# EAGLE design main (EAGLE 9.5.2)
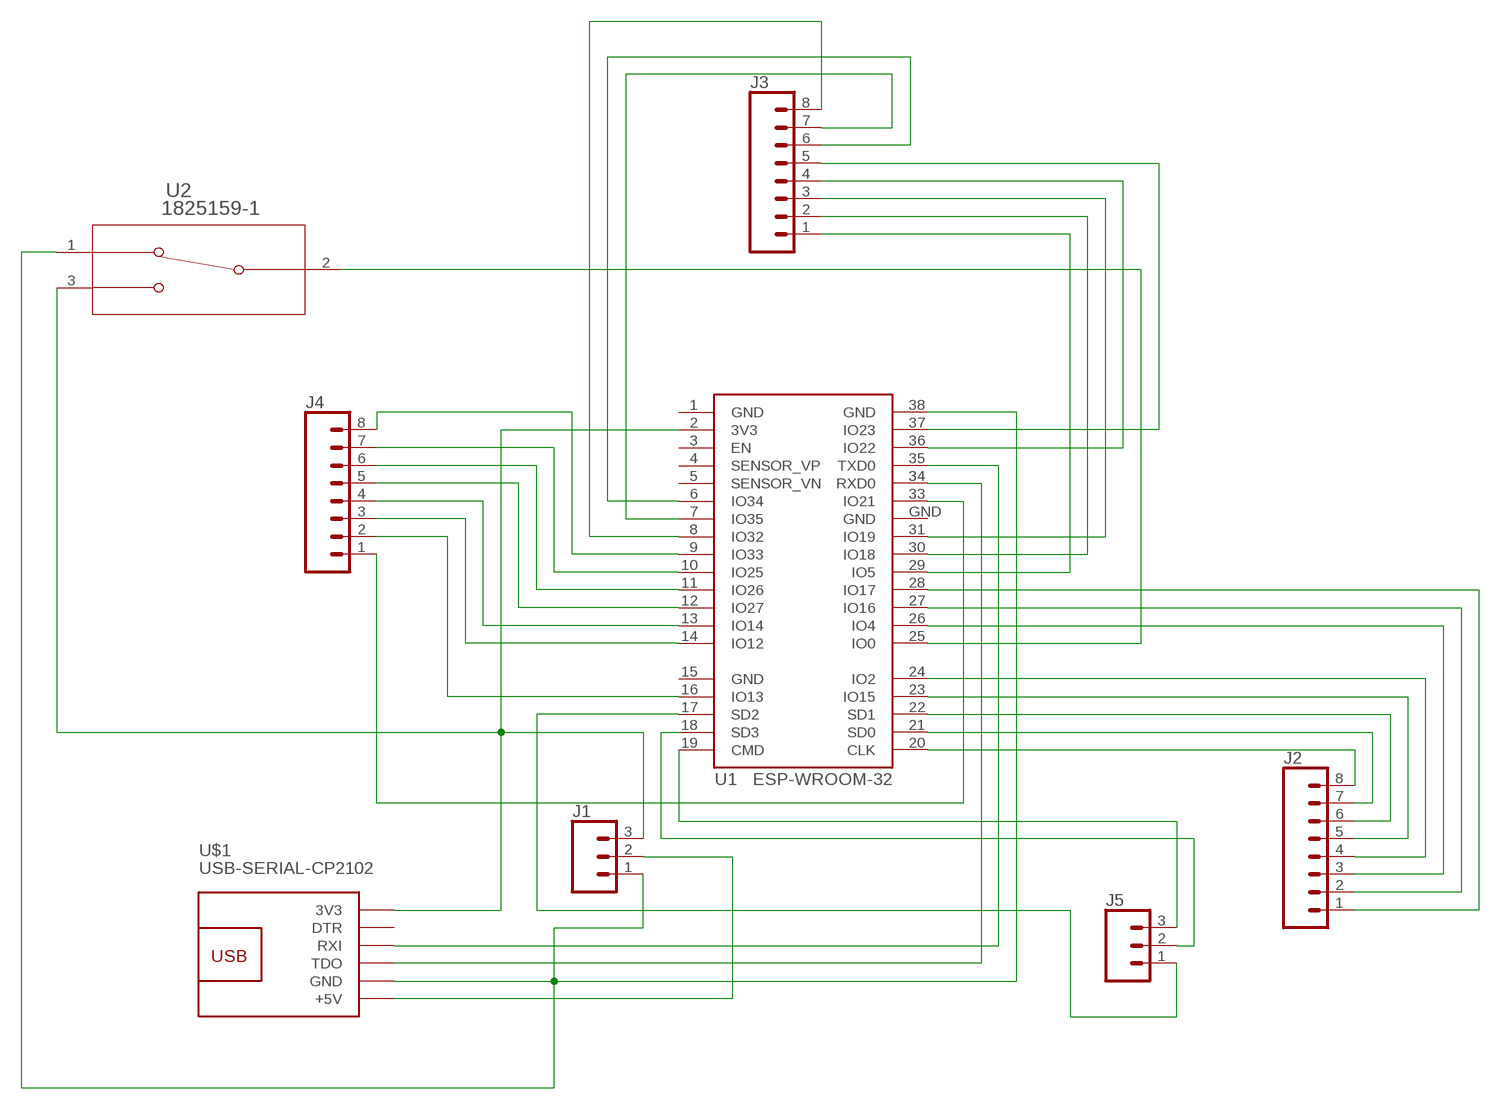
[diagram p0: schematic, sheet 1]

## Parts
J1  CONN_03  [1X03]
J2  CONN_08"  [1X08]
J3  CONN_08"  [1X08]
J4  CONN_08"  [1X08]
J5  CONN_03  [1X03]
U1  ESP-WROOM-32  [ESP-WROOM-32]
U2  1825159-1  [SW3-SLIDE-2POL_P98]
U$1  USB-SERIAL-CP2102  [USB-SERIAL-CP2102]

## Nets
N$1: J1.3 U1.2(3V3) U2.3 U$1.1(3V3)
N$2: J1.1 U1.38(GND) U2.1 U$1.5(GND)
N$3: U1.35(TXD0) U$1.3(RXI)
N$4: U1.34(RXD0) U$1.4(TDO)
N$5: U1.25(IO0) U2.2
N$6: J1.2 U$1.6(+5V)
N$7: J2.8 U1.20(CLK)
N$8: J2.7 U1.21(SD0)
N$9: J2.6 U1.22(SD1)
N$10: J2.5 U1.23(IO15)
N$11: J2.4 U1.24(IO2)
N$12: J2.3 U1.26(IO4)
N$13: J2.2 U1.27(IO16)
N$14: J2.1 U1.28(IO17)
N$15: J3.1 U1.29(IO5)
N$16: J3.2 U1.30(IO18)
N$17: J3.3 U1.31(IO19)
N$18: J3.4 U1.36(IO22)
N$19: J3.5 U1.37(IO23)
N$20: J3.6 U1.6(IO34)
N$21: J3.7 U1.7(IO35)
N$22: J3.8 U1.8(IO32)
N$23: J4.8 U1.9(IO33)
N$24: J4.7 U1.10(IO25)
N$25: J4.6 U1.11(IO26)
N$26: J4.5 U1.12(IO27)
N$27: J4.4 U1.13(IO14)
N$28: J4.3 U1.14(IO12)
N$29: J4.2 U1.16(IO13)
N$30: J4.1 U1.33(IO21)
N$31: J5.3 U1.19(CMD)
N$32: J5.2 U1.18(SD3)
N$33: J5.1 U1.17(SD2)
Unconnected: U1.3(EN) U1.4(SENSOR_VP) U1.5(SENSOR_VN) U$1.2(DTR)

## Power pins joined to a net without a drawn wire
GND: U1.1(GND) U1.15(GND) U1.GND

## Library data of the parts
J1 J5 = SparkFun-Connectors:CONN_03: Multi connection point. Often used as Generic Header-pin footprint for 0.1 inch spaced/style header connections On any of the 0.1 inch spaced packages, you can populate with these: Break Away Headers - Straight <https://www.sparkfun.com/products/116> (PRT-00116) Break Away Male Headers - Right Angle <https://www.sparkfun.com/products/553> (PRT-00553) Female Headers <https://www.sparkfun.com/products/115> (PRT-00115) Break Away Headers - Machine Pin <https://www.sparkfun.com/products/117> (PRT-00117) Break Away Female Headers - Swiss Machine Pin <https://www.sparkfun.com/products/743> (PRT-00743) Stackable Header - 3 Pin (Female, 0.1") <https://www.sparkfun.com/products/13875> (PRT-13875) For SCREWTERMINALS and SPRING TERMINALS visit here: Screw Terimnals on SparkFun.com <https://www.sparkfun.com/search/results?term=Screw+Terminals> (5mm/3.5mm/2.54mm spacing) This device is also useful as a general connection point to wire up your design to another part of your project. Our various solder wires solder well into these plated through hole pads. Hook-Up Wire - Assortment (Stranded, 22 AWG) <https://www.sparkfun.com/products/11375> (PRT-11375) Hook-Up Wire - Assortment (Solid Core, 22 AWG) <https://www.sparkfun.com/products/11367> (PRT-11367) View the entire wire category on our website here <https://www.sparkfun.com/categories/141> Special notes: Molex polarized connector foot print use with SKU : PRT-08232 with associated crimp pins and housings.
J2-J4 = SparkFun-Connectors:CONN_08: Multi connection point. Often used as Generic Header-pin footprint for 0.1 inch spaced/style header connections On any of the 0.1 inch spaced packages, you can populate with these: Break Away Headers - Straight <https://www.sparkfun.com/products/116> (PRT-00116) Break Away Male Headers - Right Angle <https://www.sparkfun.com/products/553> (PRT-00553) Female Headers <https://www.sparkfun.com/products/115> (PRT-00115) Break Away Headers - Machine Pin <https://www.sparkfun.com/products/117> (PRT-00117) Break Away Female Headers - Swiss Machine Pin <https://www.sparkfun.com/products/743> (PRT-00743) Arduino Stackable Header - 8 Pin <https://www.sparkfun.com/products/9279> (PRT-09279) For SCREWTERMINALS and SPRING TERMINALS visit here: Screw Terimnals on SparkFun.com <https://www.sparkfun.com/search/results?term=Screw+Terminals> (5mm/3.5mm/2.54mm spacing) This device is also useful as a general connection point to wire up your design to another part of your project. Our various solder wires solder well into these plated through hole pads. Hook-Up Wire - Assortment (Stranded, 22 AWG) <https://www.sparkfun.com/products/11375> (PRT-11375) Hook-Up Wire - Assortment (Solid Core, 22 AWG) <https://www.sparkfun.com/products/11367> (PRT-11367) View the entire wire category on our website here <https://www.sparkfun.com/categories/141> Special notes: Molex polarized connector foot print use with SKU : PRT-08231 with associated crimp pins and housings. 1MM SMD Version SKU: PRT-10208 NOTES ON THE VARIANTS LOCK and LOCK_LONGPADS... This footprint was designed to help hold the alignment of a through-hole component (i.e. 6-pin header) while soldering it into place. You may notice that each hole has been shifted either up or down by 0.005 of an inch from it's more standard position (which is a perfectly straight line). This slight alteration caused the pins (the squares in the middle) to touch the edges of the holes. Because they are alternating, it causes a "brace" to hold the component in place. 0.005 has proven to be the perfect amount of "off-center" position when using our standard breakaway headers. Although looks a little odd when you look at the bare footprint, once you have a header in there, the alteration is very hard to notice. Also,if you push a header all the way into place, it is covered up entirely on the bottom side.; PROD_ID: CONN-08438
U1 = esp32:ESP-WROOM-32: Espressif Systems ESP-WROOM-32
U2 = Switches:1825159-1; BUILT_BY: EMA_UL_Team; CATEGORY: Slide Switches; COPYRIGHT: Copyright (C) 2016 Accelerated Designs. All rights reserved; DESCRIPTION: STS121PC04=SPDT SLIDE SWITCH; MANUFACTURER_PART_NUMBER: 1825159-1; PART_STATUS: pending discontinuance; SERIES: Raychem STSS; VENDOR: TE Connectivity
U$1 = diy-modules:USB-SERIAL-CP2102: USB to Serial UART Converter based on CP2102 chip More information about CP2102 chip is available here: https://www.silabs.com/documents/public/data-sheets/CP2102-9.pdf Drivers for CP210x devices are available here: http://www.silabs.com/products/development-tools/software/usb-to-uart-bridge-vcp-drivers Click here to find device on ebay.com <http://www.ebay.com/sch/cp2102+micro+usb>

## Board
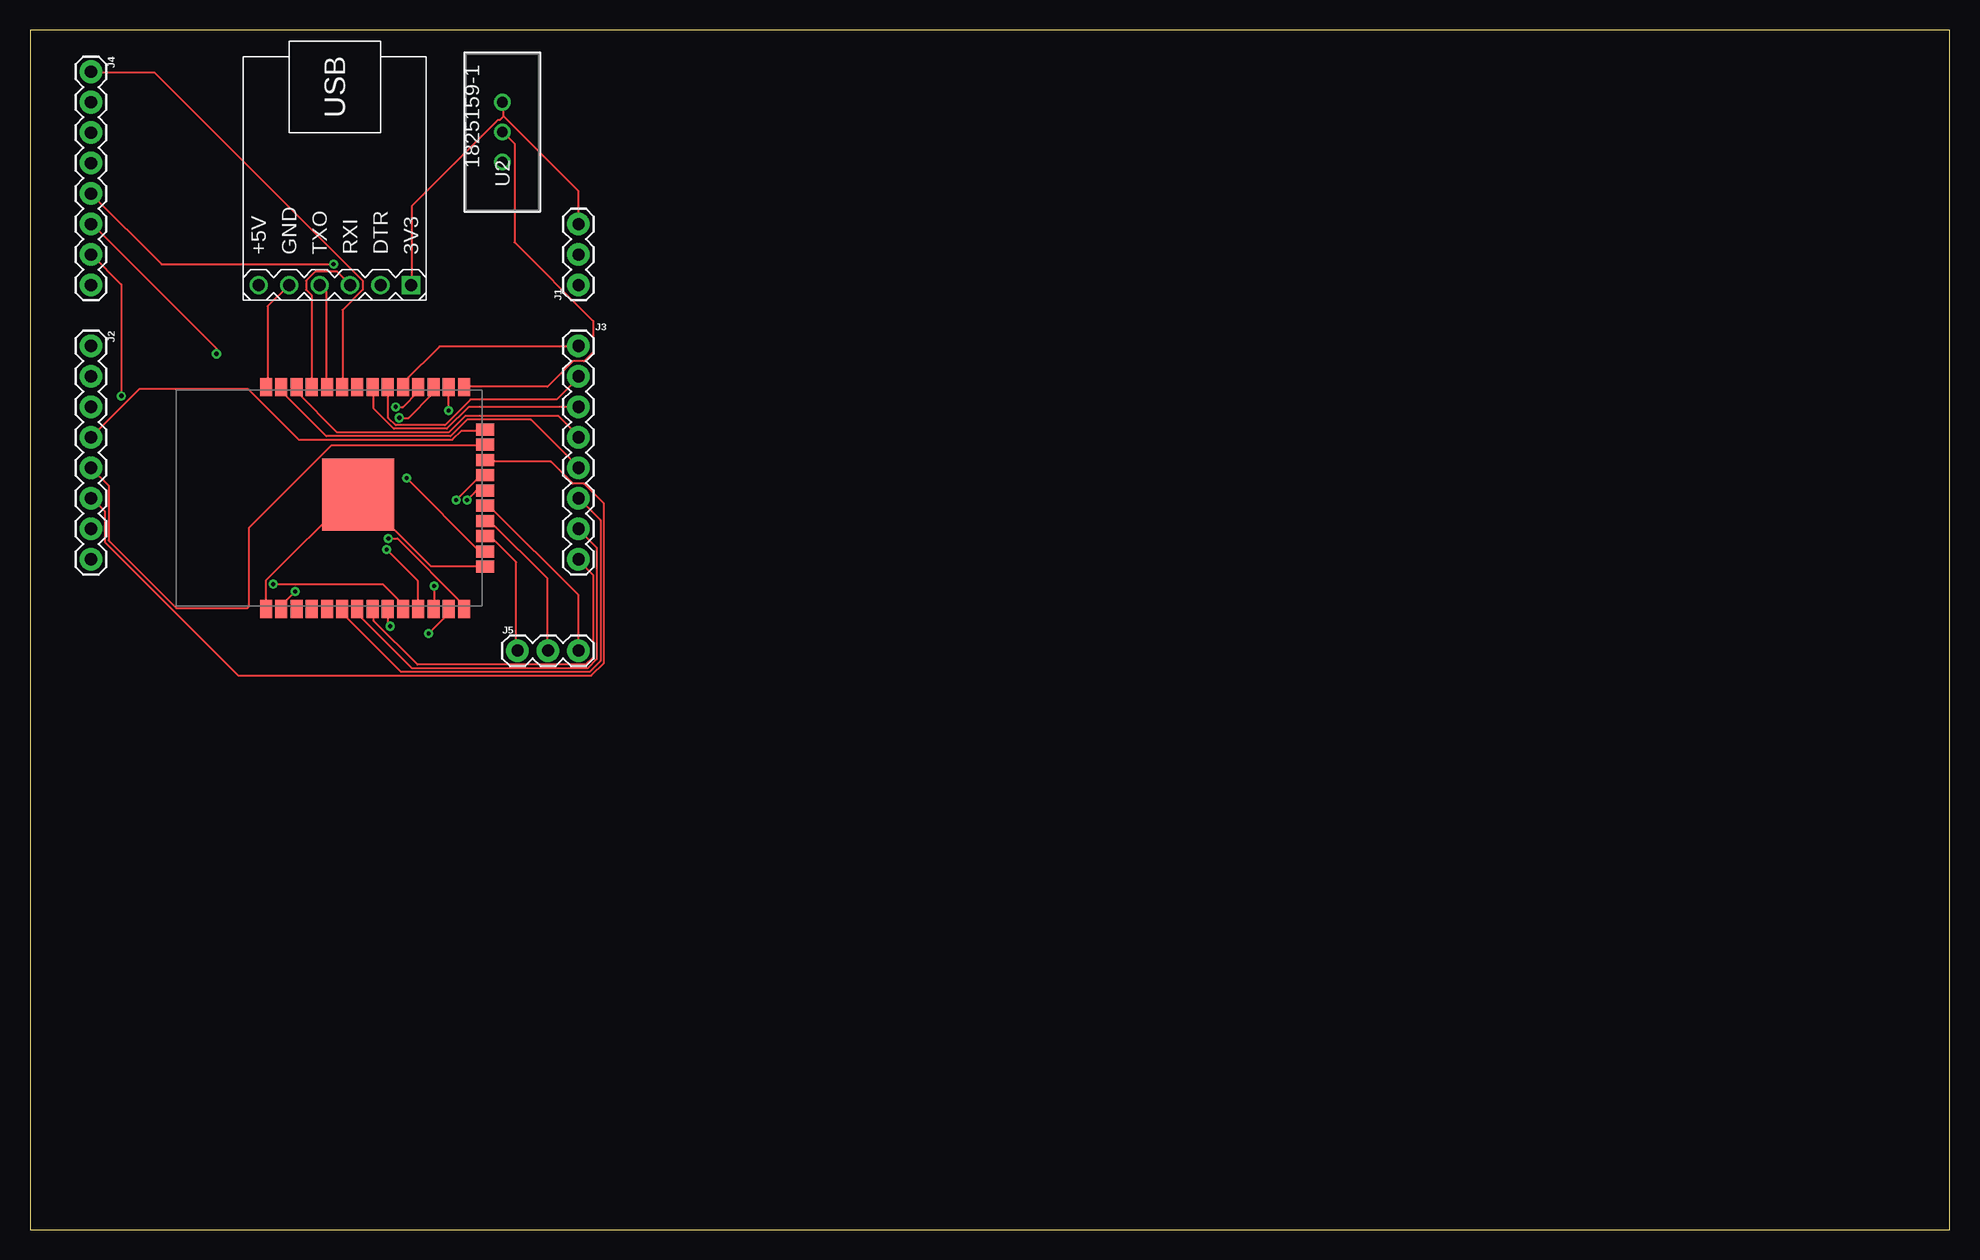
[diagram p1: board, top side]
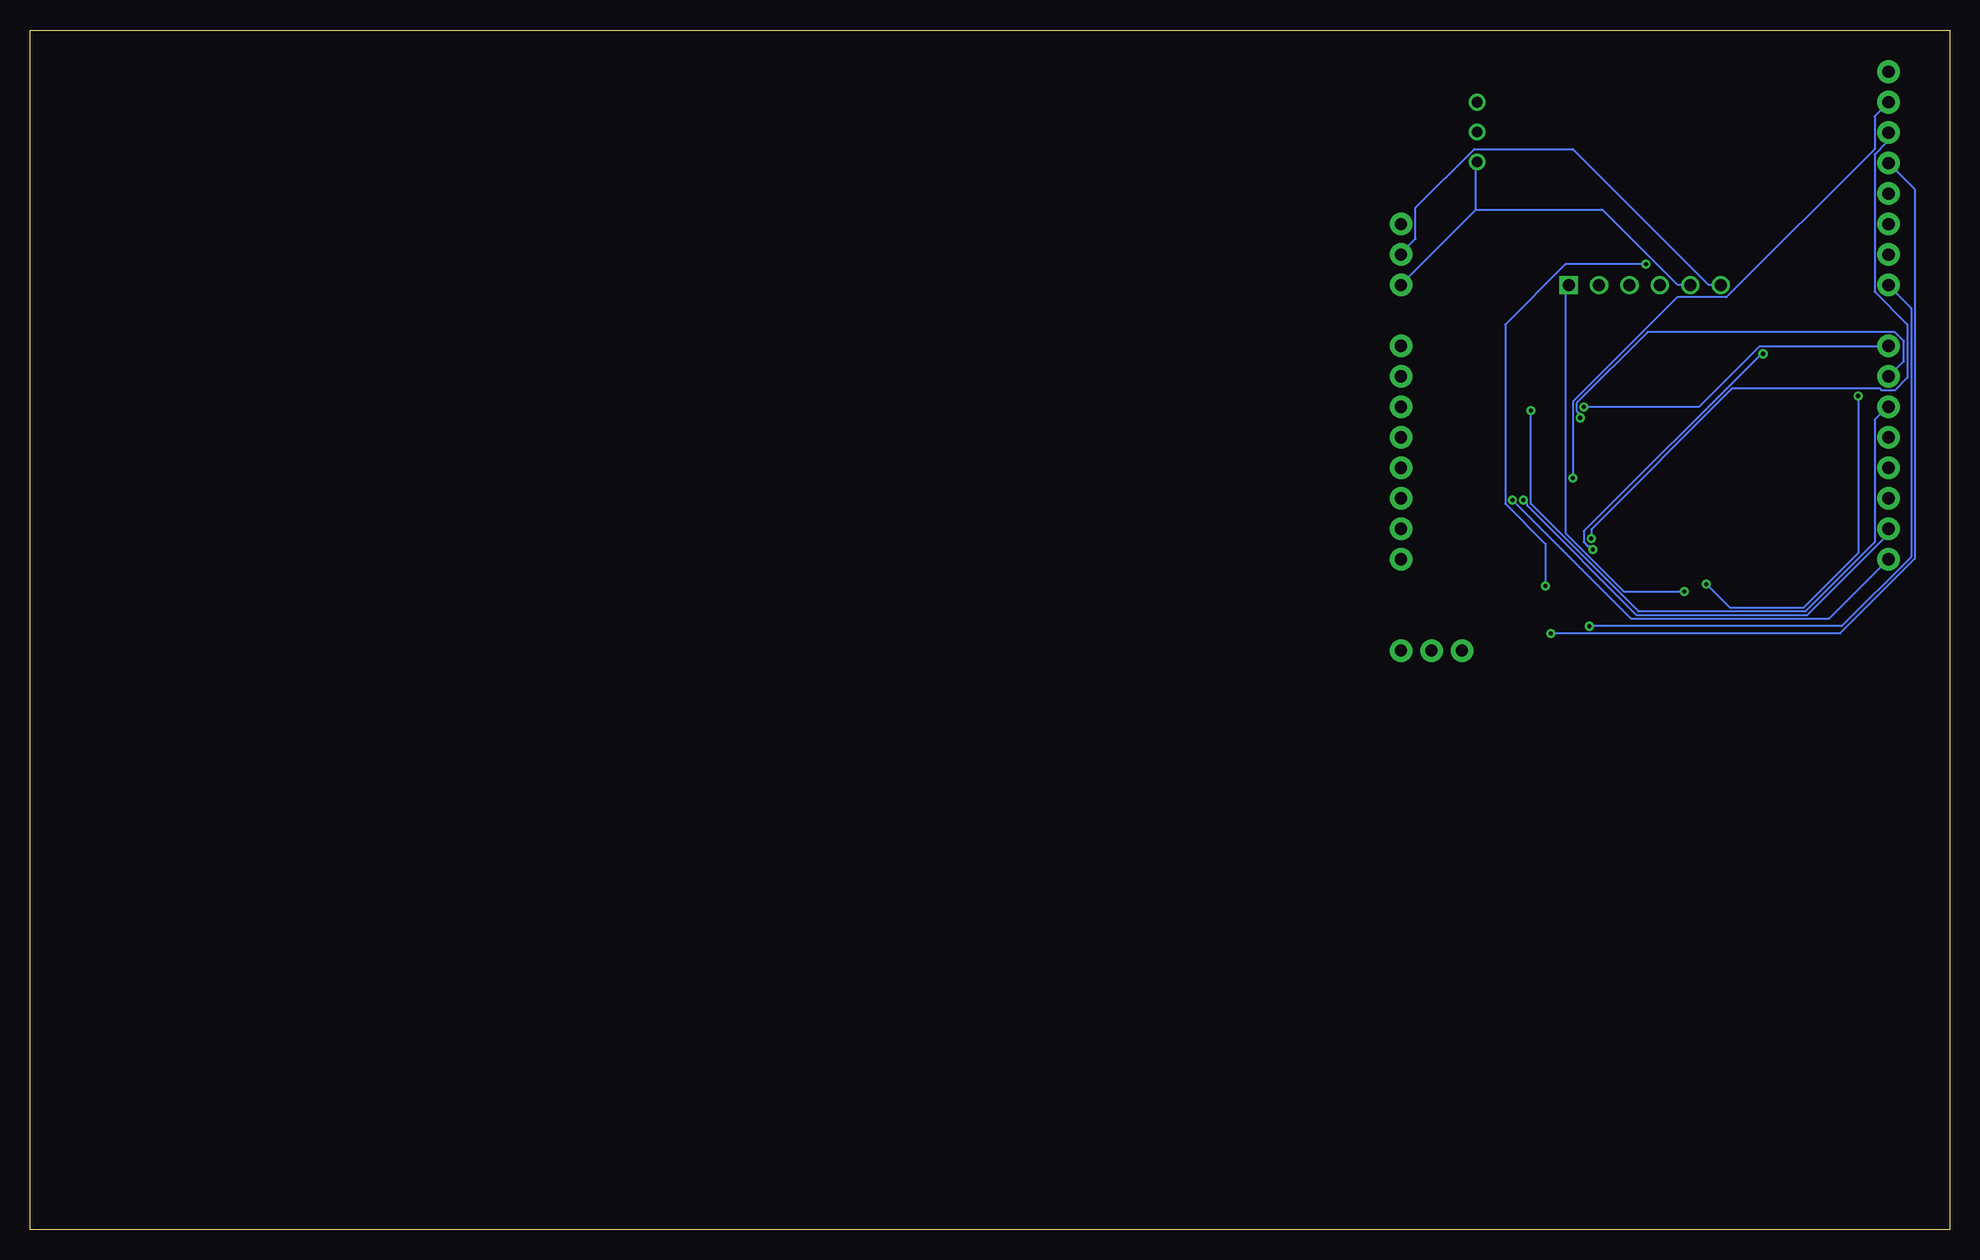
[diagram p2: board, bottom side, seen from below]

Size 160 x 100 mm. Coordinates in mm from the lower left corner, seen from the top.
Outline: 0,0 160,0 160,100 0,100 0,0
Copper layers (1*16): Top 0.035mm / dielectric 1.5mm / Bottom 0.035mm
Design rules "default": minimum track width 6mil, minimum drill 0.35mm, track to track 6mil, track to pad 6mil, pad to pad 6mil, via to via 6mil, smd to smd 6mil, copper to edge 40mil, drill to drill 6mil, minimum pad ring 10mil, minimum via ring 8mil, stop-mask expansion 4mil, vias tented up to drill 0mil, thermal gap 10mil

### Footprints (pad centres in the part's own frame; a part is rotated, then mirrored left to right if it is on the bottom)
1X03 = drill 1.016 pad 1.88: 1 0,0; 2 2.54,0; 3 5.08,0
1X08 = drill 1.016 pad 1.88: 1 0,0; 2 2.54,0; 3 5.08,0; 4 7.62,0; 5 10.16,0; 6 12.7,0; 7 15.24,0; 8 17.78,0
ESP-WROOM-32 = smd 1.5 x 1: 1 -9.25,7; 2 -9.25,5.73; 3 -9.25,4.46; 4 -9.25,3.19; 5 -9.25,1.92; 6 -9.25,0.65; 7 -9.25,-0.62; 8 -9.25,-1.89; 9 -9.25,-3.16; 10 -9.25,-4.43; 11 -9.25,-5.7; 12 -9.25,-6.97; 13 -9.25,-8.24; 14 -9.25,-9.51; 25 9.25,-9.51; 26 9.25,-8.24; 27 9.25,-6.97; 28 9.25,-5.7; 29 9.25,-4.43; 30 9.25,-3.16; 31 9.25,-1.89; 32 9.25,-0.62; 33 9.25,0.65; 34 9.25,1.92; 35 9.25,3.19; 36 9.25,4.46; 37 9.25,5.73; 38 9.25,7 | smd 1 x 1.5: 15 -5.7,-11.25; 16 -4.43,-11.25; 17 -3.16,-11.25; 18 -1.89,-11.25; 19 -0.62,-11.25; 20 0.65,-11.25; 21 1.92,-11.25; 22 3.19,-11.25; 23 4.46,-11.25; 24 5.73,-11.25 | smd 6 x 6: GND 0.3,-0.7
SW3-SLIDE-2POL_P98 = drill 0.889 pad 1.397: 1 -4.978,0; 2 -2.489,0; 3 0,0
USB-SERIAL-CP2102 = drill 1 square: 1 8.89,6.35 | drill 1: 2 8.89,3.81; 3 8.89,1.27; 4 8.89,-1.27; 5 8.89,-3.81; 6 8.89,-6.35

### Placement (x,y rotation side)
J1  45.72,78.74 90 top
J2  5.08,73.66 270 top
J3  45.72,73.66 270 top
J4  5.08,96.52 270 top
J5  40.64,48.26 0 top
U1  26.67,60.96 90 top
U2  39.37,93.98 90 top
U$1  25.4,87.63 270 top

### Tracks (layer width: path | path; a pad name or v marks a point on that pad's centre or on a via)
GND
  Top 0.152: U1.1 19.66,51.82 19.66,54.1 26.67,61.11 27.28,61.11 U1.GND 27.43,61.27 33.38,55.32 37.8,55.32 U1.15
N$1  (via drill 0.35)
  Top 0.152: 39.47,92.81 39.47,93.88 U2.3 | 39.47,92.81 45.72,86.56 J1.3 | v22.1,53.19 21.03,52.12 21.03,51.82 U1.2 | 39.47,92.81 39.17,92.51 39.01,92.51 31.85,85.34 31.85,78.79 U$1.1
  Bottom 0.152: v22.1,53.19 27.13,53.19 32,58.06 32,78.49 U$1.1
N$2
  Top 0.152: U$1.5 19.81,76.96 19.81,70.26 U1.38
  Bottom 0.152: 39.47,85.04 39.47,89 U2.1 | 39.47,85.04 45.72,78.79 J1.1 | 39.47,85.04 28.96,85.04 22.71,78.79 21.64,78.79 U$1.5
N$3
  Top 0.152: U1.35 23.47,70.26 23.47,77.88 23.01,78.33 23.01,79.1 23.77,79.86 25.6,79.86 26.67,78.79 U$1.3
N$4
  Top 0.152: U$1.4 24.69,78.18 24.69,70.26 U1.34
N$5
  Top 0.152: U1.25 36.27,70.26 43.13,70.26 45.26,72.39 46.18,72.39 46.94,73.15 46.94,75.74 40.39,82.3 40.39,90.53 39.47,91.44 U2.2
N$6
  Bottom 0.152: U$1.6 19.05,78.79 20.12,78.79 31.39,90.07 39.62,90.07 44.5,85.19 44.5,82.6 45.72,81.38 J1.2
N$7  (via drill 0.35)
  Top 0.152: v36.42,60.81 37.19,61.57 37.8,61.57 U1.20
  Bottom 0.152: v36.42,60.81 26.52,50.9 10.06,50.9 J2.8
N$8  (via drill 0.35)
  Top 0.152: v35.51,60.81 37.49,62.79 37.8,62.79 U1.21
  Bottom 0.152: v35.51,60.81 35.2,60.5 35.2,60.35 26.06,51.21 11.89,51.21 5.18,57.91 5.18,58.37 J2.7
N$9
  Top 0.152: U1.22 37.95,64.01 43.43,64.01 45.26,62.18 46.18,62.18 47.85,60.5 47.85,47.24 46.79,46.18 17.37,46.18 6.25,57.3 6.25,59.89 5.18,60.96 J2.6
N$10
  Top 0.152: J2.5 6.55,62.03 6.55,57.45 12.19,51.82 18.14,51.82 18.29,51.97 18.29,58.52 25.15,65.38 37.8,65.38 U1.23
N$11
  Top 0.152: J2.4 9.14,70.1 18.14,70.1 22.4,65.84 35.2,65.84 35.97,66.6 37.8,66.6 U1.24
N$12  (via drill 0.35)
  Top 0.152: v34.9,68.28 34.9,70.1 U1.26
  Bottom 0.152: v34.9,68.28 34.9,60.5 25.91,51.51 12.04,51.51 6.25,57.3 6.25,67.51 5.18,68.58 J2.3
N$13  (via drill 0.35)
  Top 0.152: v30.79,67.67 31.55,67.67 33.53,69.65 33.53,70.1 U1.27
  Bottom 0.152: v30.79,67.67 30.79,67.97 31.09,68.28 31.09,68.89 25.15,74.83 4.57,74.83 3.81,74.07 3.81,72.39 J2.2
N$14  (via drill 0.35)
  Top 0.152: v30.48,68.58 31.09,68.58 32.31,69.8 32.31,70.1 U1.28
  Bottom 0.152: v30.48,68.58 20.88,68.58 15.85,73.61 5.18,73.61 J2.1
N$15
  Top 0.152: U1.29 31.24,70.26 31.24,70.71 34.14,73.61 45.72,73.61 J3.1
N$16
  Top 0.152: U1.30 29.87,70.1 29.87,67.67 30.48,67.06 34.59,67.06 36.73,69.19 43.89,69.19 45.72,71.02 J3.2
N$17
  Top 0.152: J3.3 36.58,68.58 34.75,66.75 30.33,66.75 28.65,68.43 28.65,70.1 U1.31
N$18
  Top 0.152: U1.36 22.25,70.1 22.25,69.8 25.6,66.45 34.9,66.45 36.27,67.82 44.04,67.82 45.72,66.14 J3.4
N$19
  Top 0.152: U1.37 21.03,70.1 21.03,69.8 24.69,66.14 35.05,66.14 36.42,67.51 41.76,67.51 45.72,63.55 J3.5
N$20
  Top 0.152: J3.6 47.55,59.13 47.55,47.4 46.63,46.48 30.94,46.48 26.06,51.36 26.06,51.66 U1.6
N$21
  Top 0.152: U1.7 27.43,51.66 27.43,51.21 31.85,46.79 46.48,46.79 47.24,47.55 47.24,56.84 45.72,58.37 J3.7
N$22
  Top 0.152: U1.8 28.65,51.66 28.65,50.75 32.31,47.09 46.33,47.09 46.94,47.7 46.94,54.56 45.72,55.78 J3.8
N$23  (via drill 0.35)
  Top 0.152: v30.02,50.29 29.87,50.44 29.87,51.66 U1.9
  Bottom 0.152: v30.02,50.29 8.99,50.29 3.2,56.08 3.2,76.81 5.03,78.64 J4.8
N$24  (via drill 0.35)
  Top 0.152: v20.27,53.8 29.41,53.8 31.09,52.12 31.09,51.82 U1.10 | v7.62,69.49 7.62,78.79 5.18,81.23 J4.7
  Bottom 0.152: v20.27,53.8 18.29,51.82 12.19,51.82 7.62,56.39 v7.62,69.49
N$25  (via drill 0.35)
  Top 0.152: v29.72,56.69 32.31,54.1 32.31,51.82 U1.11 | v15.54,73 15.54,73.46 5.18,83.82 J4.6
  Bottom 0.152: v29.72,56.69 30.02,57 30.18,57 30.48,57.3 30.48,58.22 15.7,73 v15.54,73
N$26  (via drill 0.35)
  Top 0.152: v33.68,53.65 33.68,51.82 U1.12 | v25.3,80.47 10.97,80.47 J4.5
  Bottom 0.152: v33.68,53.65 33.68,57.15 37.03,60.5 37.03,75.44 32,80.47 v25.3,80.47
N$27  (via drill 0.35)
  Top 0.152: v33.22,49.68 34.9,51.36 34.9,51.66 U1.13
  Bottom 0.152: v33.22,49.68 9.14,49.68 2.9,55.93 2.9,86.72 J4.4
N$28  (via drill 0.35)
  Top 0.152: v29.87,57.61 30.63,57.61 36.12,52.12 36.12,51.82 U1.14
  Bottom 0.152: v29.87,57.61 29.87,58.37 18.14,70.1 5.79,70.1 5.64,69.95 4.57,69.95 3.5,71.02 3.5,75.44 6.25,78.18 6.25,89.61 5.18,90.68 5.18,91.44 J4.3
N$29  (via drill 0.35)
  Top 0.152: v31.39,62.64 37.49,56.54 37.8,56.54 U1.16
  Bottom 0.152: v31.39,62.64 31.39,69.04 22.71,77.72 18.59,77.72 6.25,90.07 6.25,92.81 J4.2
N$30
  Top 0.152: U1.33 26.06,70.26 26.06,76.66 27.74,78.33 27.74,79.1 10.36,96.47 5.18,96.47 J4.1
N$31
  Top 0.152: J5.3 45.72,52.88 38.41,60.2 37.95,60.2 U1.19
N$32
  Top 0.152: U1.18 37.95,58.98 38.41,58.98 43.13,54.25 43.13,48.31 J5.2
N$33
  Top 0.152: U1.17 37.95,57.76 38.41,57.76 40.54,55.63 40.54,48.31 J5.1